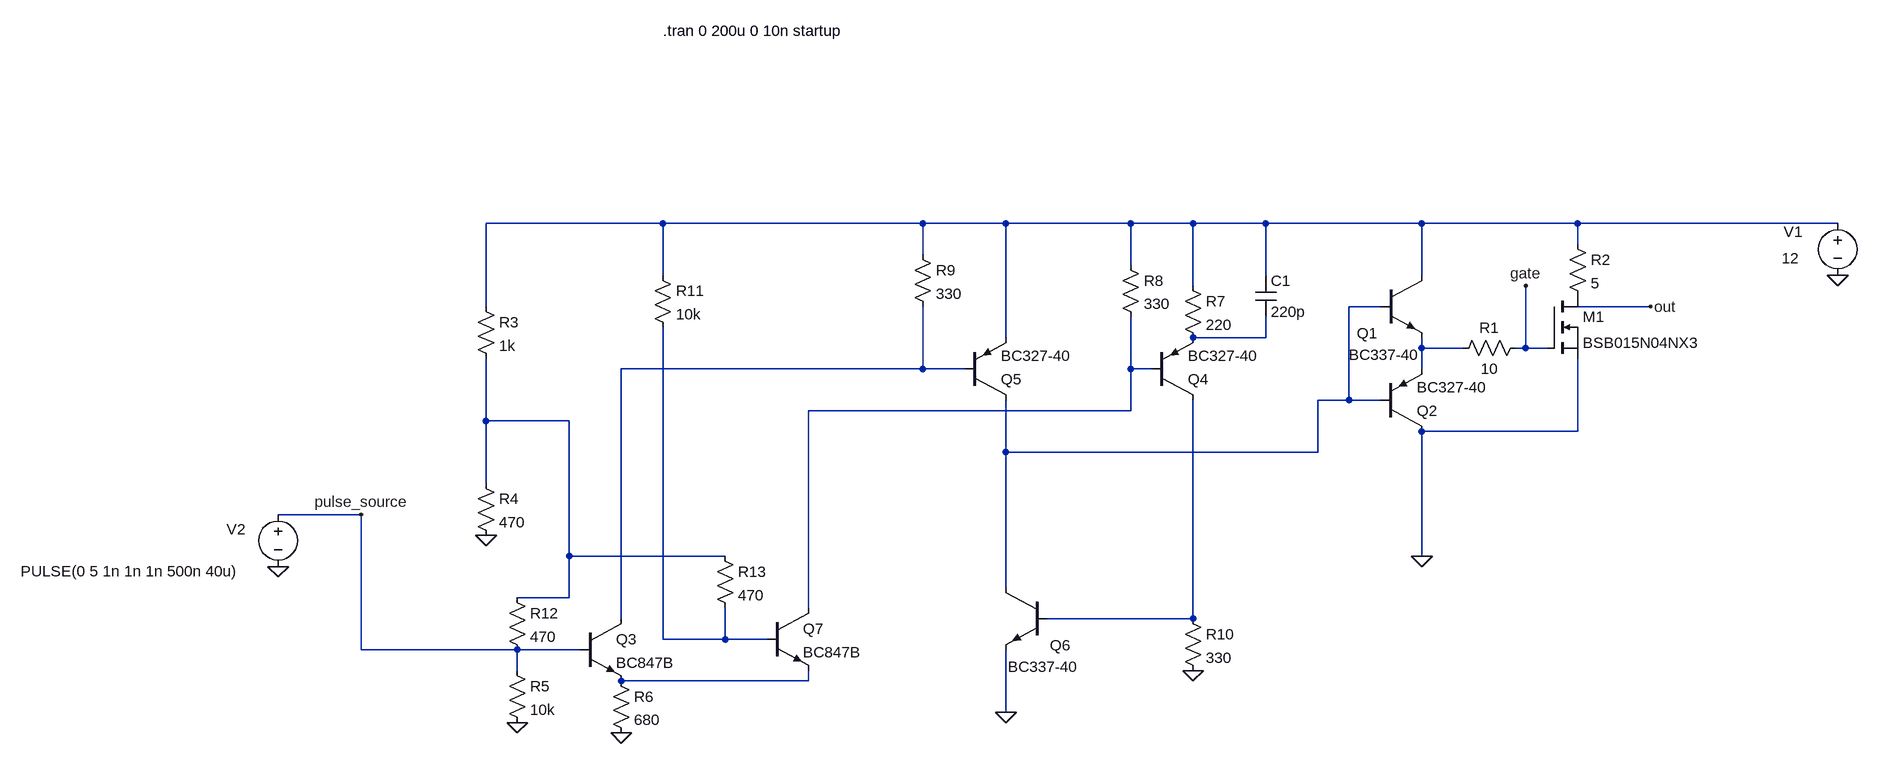
[diagram p0: schematic totem-pole driver low side complementary.asc]
totem-pole driver low side complementary.asc, the LTspice schematic file:
Version 4
SHEET 1 1708 932
WIRE -1360 32 -1632 32
WIRE -960 32 -1360 32
WIRE -832 32 -960 32
WIRE -640 32 -832 32
WIRE -544 32 -640 32
WIRE -432 32 -544 32
WIRE -192 32 -432 32
WIRE 48 32 -192 32
WIRE 448 32 48 32
WIRE 48 64 48 32
WIRE -960 80 -960 32
WIRE -640 96 -640 32
WIRE -1360 112 -1360 32
WIRE -432 112 -432 32
WIRE -192 112 -192 32
WIRE -544 128 -544 32
WIRE -1632 160 -1632 32
WIRE -256 160 -304 160
WIRE 160 160 48 160
WIRE -832 208 -832 32
WIRE -432 208 -432 176
WIRE -432 208 -544 208
WIRE -192 224 -192 208
WIRE -128 224 -192 224
WIRE -32 224 -32 128
WIRE -32 224 -48 224
WIRE 0 224 -32 224
WIRE -960 256 -960 160
WIRE -960 256 -1424 256
WIRE -896 256 -960 256
WIRE -640 256 -640 176
WIRE -608 256 -640 256
WIRE -192 256 -192 224
WIRE -304 304 -304 160
WIRE -304 304 -352 304
WIRE -256 304 -304 304
WIRE -640 320 -640 256
WIRE -640 320 -1136 320
WIRE -1632 336 -1632 240
WIRE -1504 336 -1632 336
WIRE 48 352 48 240
WIRE 48 352 -192 352
WIRE -832 384 -832 304
WIRE -352 384 -352 304
WIRE -352 384 -832 384
WIRE -1632 432 -1632 336
WIRE -1824 480 -1952 480
WIRE -1504 544 -1504 336
WIRE -1264 544 -1504 544
WIRE -192 544 -192 352
WIRE -832 592 -832 384
WIRE -1504 608 -1504 544
WIRE -1504 608 -1584 608
WIRE -1136 624 -1136 320
WIRE -1424 640 -1424 256
WIRE -544 640 -544 304
WIRE -544 640 -768 640
WIRE -1360 672 -1360 192
WIRE -1264 672 -1264 624
WIRE -1264 672 -1360 672
WIRE -1200 672 -1264 672
WIRE -1824 688 -1824 480
WIRE -1584 688 -1824 688
WIRE -1488 688 -1584 688
WIRE -1584 720 -1584 688
WIRE -1136 736 -1136 720
WIRE -1136 736 -1424 736
WIRE -832 784 -832 688
FLAG -1952 560 0
FLAG -1824 480 pulse_source
FLAG 160 160 out
FLAG -32 128 gate
FLAG -192 544 0
FLAG -1424 816 0
FLAG -544 720 0
FLAG -832 784 0
FLAG -1632 512 0
FLAG -1584 800 0
FLAG 448 112 0
SYMBOL npn -256 112 R0
WINDOW 0 -36 89 Left 2
WINDOW 3 -48 122 Left 2
SYMATTR InstName Q1
SYMATTR Value BC337-40
SYMBOL pnp -256 352 M180
SYMATTR InstName Q2
SYMATTR Value BC327-40
SYMBOL voltage 448 16 R0
WINDOW 0 -83 29 Left 2
WINDOW 3 -86 70 Left 2
WINDOW 123 0 0 Left 0
WINDOW 39 0 0 Left 0
SYMATTR InstName V1
SYMATTR Value 12
SYMBOL voltage -1952 464 R0
WINDOW 0 -79 39 Left 2
WINDOW 3 -396 103 Left 2
WINDOW 123 0 0 Left 0
WINDOW 39 0 0 Left 0
SYMATTR InstName V2
SYMATTR Value PULSE(0 5 1n 1n 1n 500n 40u)
SYMBOL npn -1488 640 R0
SYMATTR InstName Q3
SYMATTR Value BC847B
SYMBOL res -32 208 R90
WINDOW 0 0 56 VBottom 2
WINDOW 3 32 56 VTop 2
SYMATTR InstName R1
SYMATTR Value 10
SYMBOL res 32 48 R0
SYMATTR InstName R2
SYMATTR Value 5
SYMBOL nmos 0 144 R0
SYMATTR InstName M1
SYMATTR Value BSB015N04NX3
SYMBOL res -1440 720 R0
SYMATTR InstName R6
SYMATTR Value 680
SYMBOL pnp -608 304 M180
SYMATTR InstName Q4
SYMATTR Value BC327-40
SYMBOL res -560 112 R0
SYMATTR InstName R7
SYMATTR Value 220
SYMBOL cap -448 112 R0
SYMATTR InstName C1
SYMATTR Value 220p
SYMBOL pnp -896 304 M180
SYMATTR InstName Q5
SYMATTR Value BC327-40
SYMBOL res -656 80 R0
SYMATTR InstName R8
SYMATTR Value 330
SYMBOL res -976 64 R0
SYMATTR InstName R9
SYMATTR Value 330
SYMBOL npn -768 592 M0
WINDOW 0 -36 89 Left 2
WINDOW 3 -48 122 Left 2
SYMATTR InstName Q6
SYMATTR Value BC337-40
SYMBOL res -560 624 R0
SYMATTR InstName R10
SYMATTR Value 330
SYMBOL npn -1200 624 R0
SYMATTR InstName Q7
SYMATTR Value BC847B
SYMBOL res -1648 144 R0
SYMATTR InstName R3
SYMATTR Value 1k
SYMBOL res -1648 416 R0
SYMATTR InstName R4
SYMATTR Value 470
SYMBOL res -1600 704 R0
SYMATTR InstName R5
SYMATTR Value 10k
SYMBOL res -1376 96 R0
SYMATTR InstName R11
SYMATTR Value 10k
SYMBOL res -1600 592 R0
SYMATTR InstName R12
SYMATTR Value 470
SYMBOL res -1280 528 R0
SYMATTR InstName R13
SYMATTR Value 470
TEXT -1360 -264 Left 2 !.tran 0 200u 0 10n startup

The netlist it stands for:
* totem-pole driver low side complementary.asc
Q1 N001 N002 N004 0 BC337-40
Q2 0 N002 N004 0 BC327-40
V1 N001 0 12
V2 pulse_source 0 PULSE(0 5 1n 1n 1n 500n 40u)
Q3 N005 pulse_source N010 0 BC847B
R1 gate N004 10
R2 N001 P001 5
M1 P001 gate 0 0 BSB015N04NX3
R6 N010 0 680
Q4 N008 N006 N003 0 BC327-40
R7 N001 N003 220
C1 N001 N003 220p
Q5 N002 N005 N001 0 BC327-40
R8 N001 N006 330
R9 N001 N005 330
Q6 N002 N008 0 0 BC337-40
R10 N008 0 330
Q7 N006 N009 N010 0 BC847B
R3 N001 N007 1k
R4 N007 0 470
R5 pulse_source 0 10k
R11 N001 N009 10k
R12 N007 pulse_source 470
R13 N007 N009 470
.model NPN NPN
.model PNP PNP
.lib standard.bjt
.model NMOS NMOS
.model PMOS PMOS
.lib standard.mos
.tran 0 200u 0 10n startup
.backanno
.end